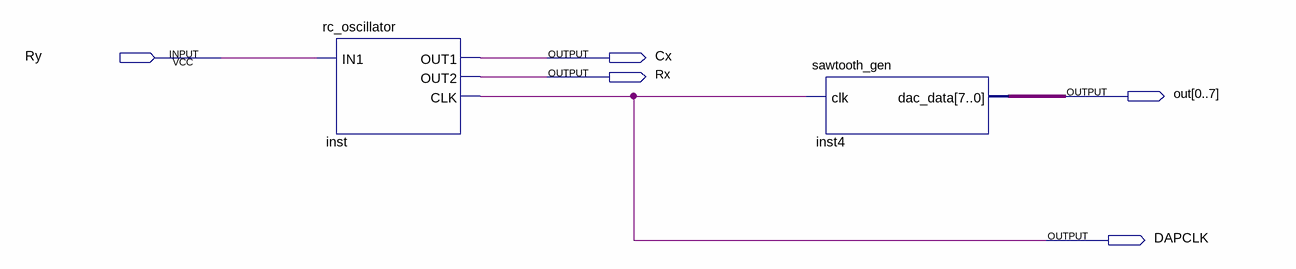
[diagram p0: schematic sheet]
// Quartus schematic DFG.bdf as structural Verilog: 2 symbols, 5 pins
module DFG (
  input  Ry,
  output Cx,
  output Rx,
  output [0:7] out,
  output DAPCLK
);

  rc_oscillator inst (.IN1(Ry), .OUT1(Cx), .OUT2(Rx), .CLK(DAPCLK));
  sawtooth_gen inst4 (.clk(DAPCLK), .dac_data(out));
endmodule
